# EAGLE design mux2 (EAGLE 6.5.0)
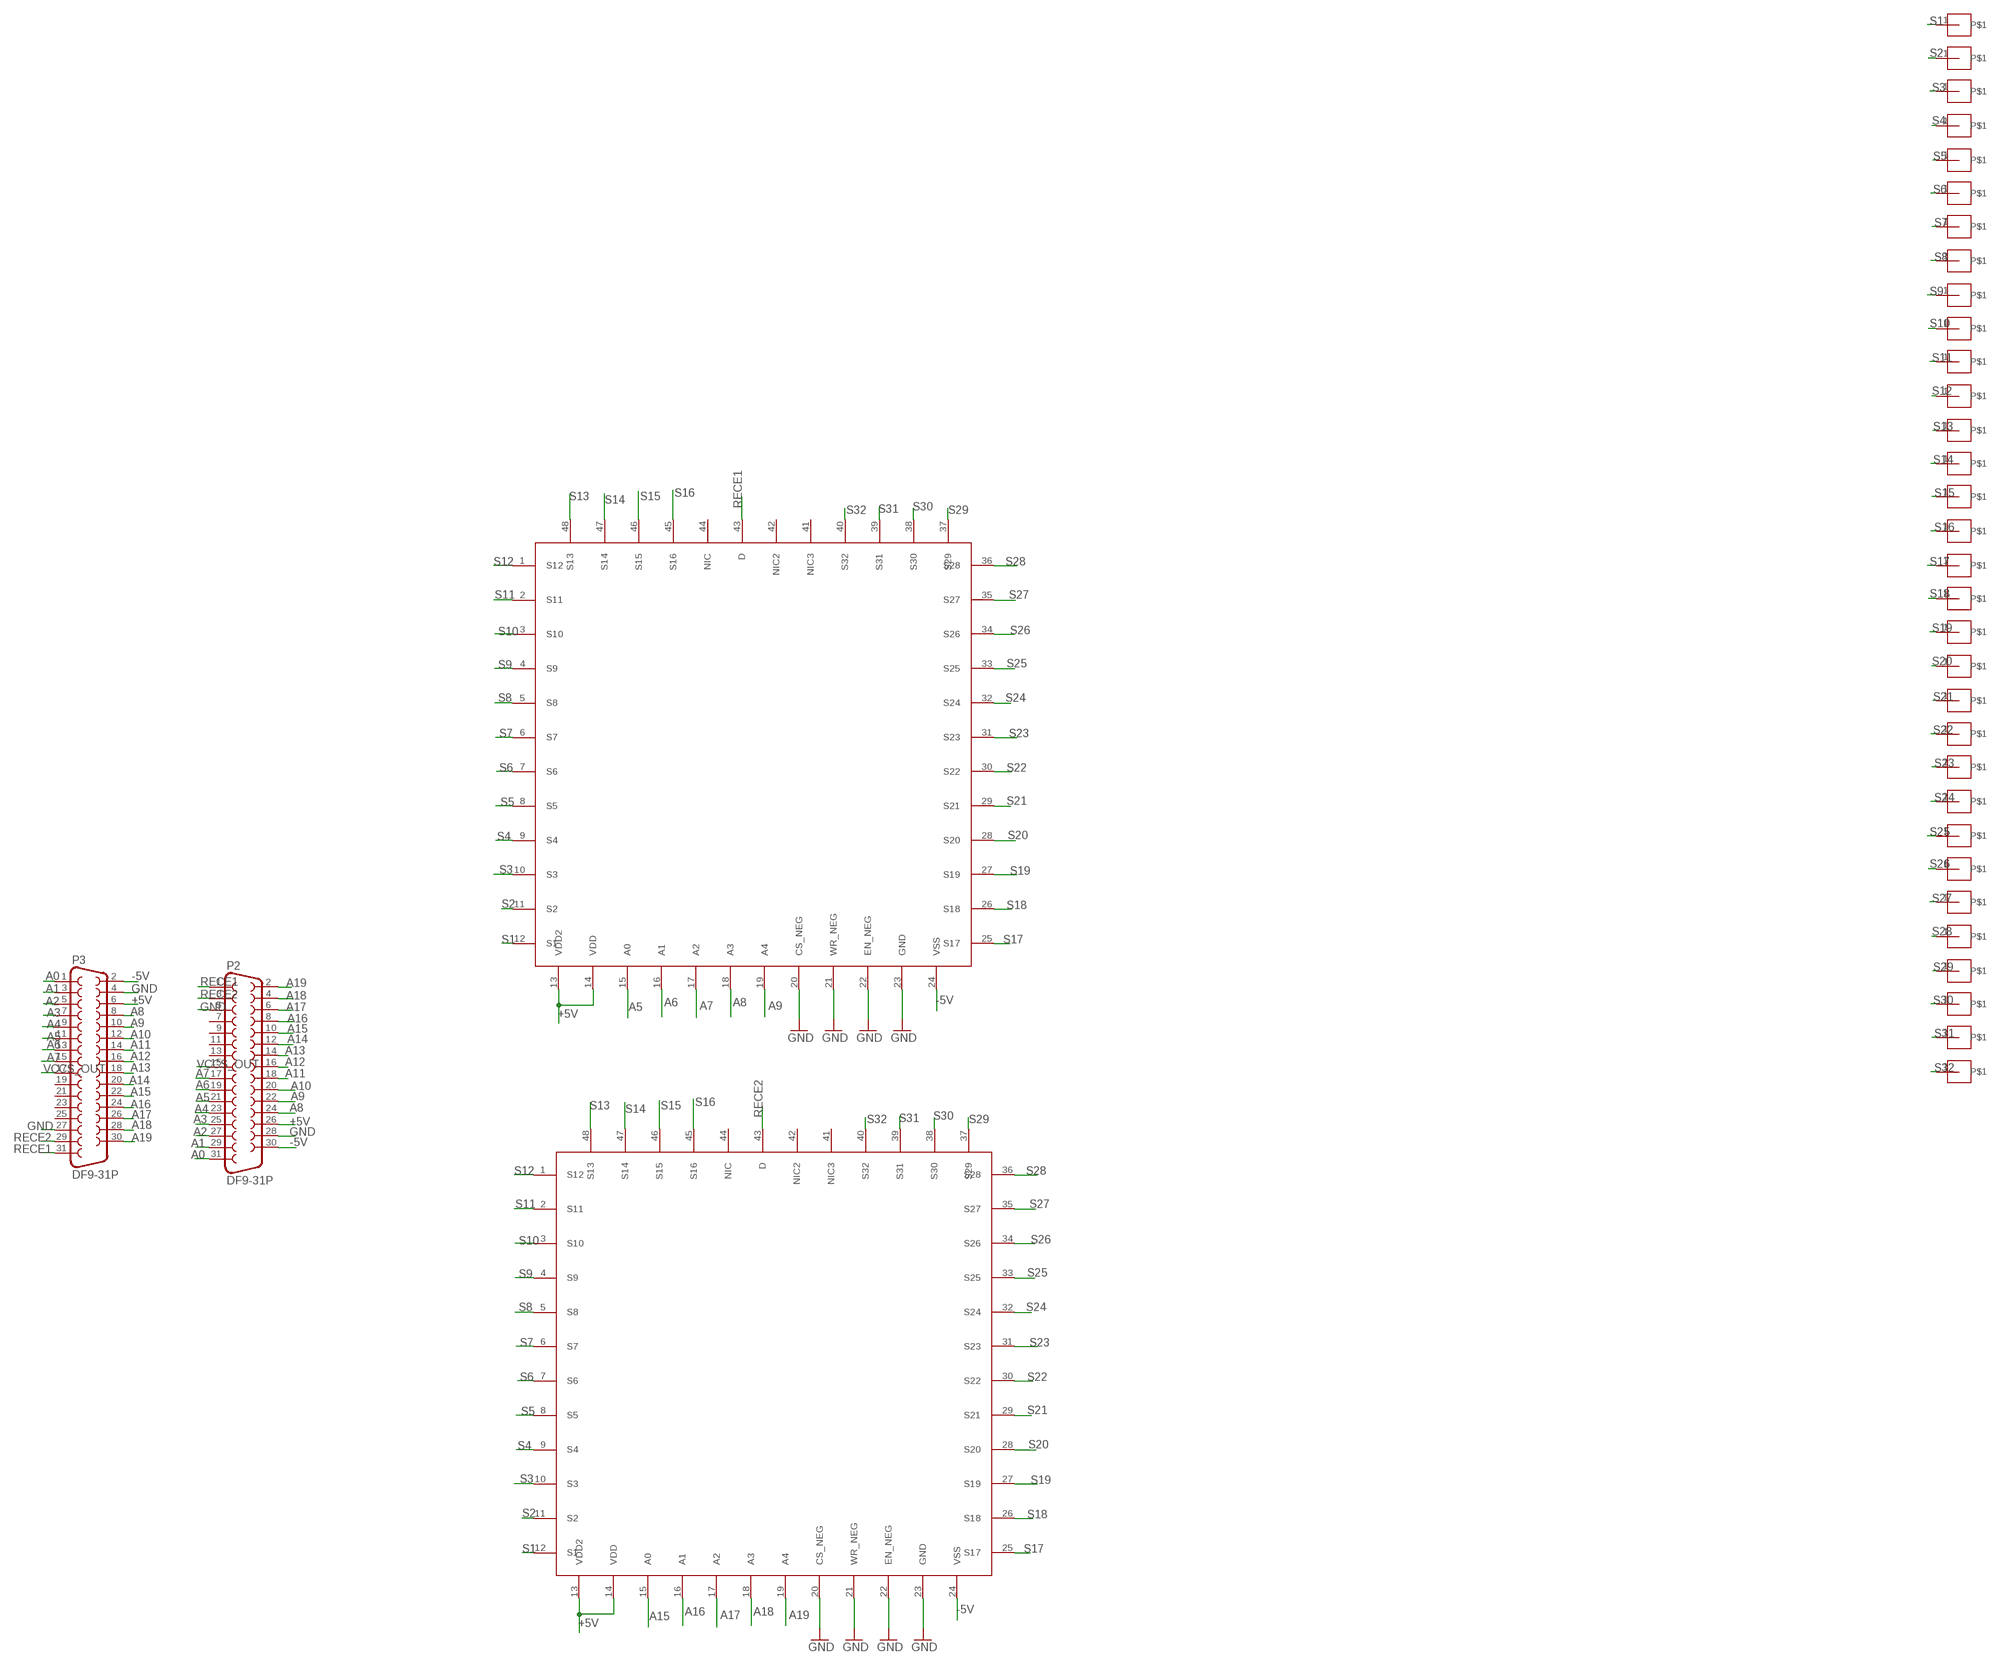
[diagram p0: schematic, sheet 1]

## Parts
P2  DF9-31P  [DF9-31P]
P3  DF9-31P  [DF9-31P]
U$25  M01  [M01]
U$26  M01  [M01]
U$27  M01  [M01]
U$28  M01  [M01]
U$29  M01  [M01]
U$30  M01  [M01]
U$31  M01  [M01]
U$32  M01  [M01]
U$33  M01  [M01]
U$34  M01  [M01]
U$35  M01  [M01]
U$36  M01  [M01]
U$37  M01  [M01]
U$38  M01  [M01]
U$39  M01  [M01]
U$40  M01  [M01]
U$41  M01  [M01]
U$42  M01  [M01]
U$43  M01  [M01]
U$44  M01  [M01]
U$45  M01  [M01]
U$46  M01  [M01]
U$47  M01  [M01]
U$48  M01  [M01]
U$49  M01  [M01]
U$50  M01  [M01]
U$51  M01  [M01]
U$52  M01  [M01]
U$53  M01  [M01]
U$54  M01  [M01]
U$55  M01  [M01]
U$56  M01  [M01]
U$73  ADG732  [TQFP48]
U$74  ADG732  [TQFP48]

## Nets
+5V: P2.26 P3.6 U$73.13(VDD2) U$73.14(VDD) U$74.13(VDD2) U$74.14(VDD)
-5V: P2.30 P3.2 U$73.24(VSS) U$74.24(VSS)
A0: P2.31 P3.1
A1: P2.29 P3.3
A2: P2.27 P3.5
A3: P2.25 P3.7
A4: P2.23 P3.9
A5: P2.21 P3.11 U$74.15(A0)
A6: P2.19 P3.13 U$74.16(A1)
A7: P2.17 P3.15 U$74.17(A2)
A8: P2.24 P3.8 U$74.18(A3)
A9: P2.22 P3.10 U$74.19(A4)
A10: P2.20 P3.12
A11: P2.18 P3.14
A12: P2.16 P3.16
A13: P2.14 P3.18
A14: P2.12 P3.20
A15: P2.10 P3.22 U$73.15(A0)
A16: P2.8 P3.24 U$73.16(A1)
A17: P2.6 P3.26 U$73.17(A2)
A18: P2.4 P3.28 U$73.18(A3)
A19: P2.2 P3.30 U$73.19(A4)
GND: P2.5 P2.28 P3.4 P3.27 U$73.20(CS_NEG) U$73.21(WR_NEG) U$73.22(EN_NEG) U$73.23(GND) U$74.20(CS_NEG) U$74.21(WR_NEG) U$74.22(EN_NEG) U$74.23(GND)
RECE1: P2.1 P3.31 U$74.43(D)
RECE2: P2.3 P3.29 U$73.43(D)
S1: U$25.1 U$73.12(S1) U$74.12(S1)
S2: U$26.1 U$73.11(S2) U$74.11(S2)
S3: U$27.1 U$73.10(S3) U$74.10(S3)
S4: U$28.1 U$73.9(S4) U$74.9(S4)
S5: U$29.1 U$73.8(S5) U$74.8(S5)
S6: U$30.1 U$73.7(S6) U$74.7(S6)
S7: U$31.1 U$73.6(S7) U$74.6(S7)
S8: U$32.1 U$73.5(S8) U$74.5(S8)
S9: U$33.1 U$73.4(S9) U$74.4(S9)
S10: U$34.1 U$73.3(S10) U$74.3(S10)
S11: U$35.1 U$73.2(S11) U$74.2(S11)
S12: U$36.1 U$73.1(S12) U$74.1(S12)
S13: U$37.1 U$73.48(S13) U$74.48(S13)
S14: U$38.1 U$73.47(S14) U$74.47(S14)
S15: U$39.1 U$73.46(S15) U$74.46(S15)
S16: U$40.1 U$73.45(S16) U$74.45(S16)
S17: U$41.1 U$73.25(S17) U$74.25(S17)
S18: U$42.1 U$73.26(S18) U$74.26(S18)
S19: U$43.1 U$73.27(S19) U$74.27(S19)
S20: U$44.1 U$73.28(S20) U$74.28(S20)
S21: U$45.1 U$73.29(S21) U$74.29(S21)
S22: U$46.1 U$73.30(S22) U$74.30(S22)
S23: U$47.1 U$73.31(S23) U$74.31(S23)
S24: U$48.1 U$73.32(S24) U$74.32(S24)
S25: U$49.1 U$73.33(S25) U$74.33(S25)
S26: U$50.1 U$73.34(S26) U$74.34(S26)
S27: U$51.1 U$73.35(S27) U$74.35(S27)
S28: U$52.1 U$73.36(S28) U$74.36(S28)
S29: U$53.1 U$73.37(S29) U$74.37(S29)
S30: U$54.1 U$73.38(S30) U$74.38(S30)
S31: U$55.1 U$73.39(S31) U$74.39(S31)
S32: U$56.1 U$73.40(S32) U$74.40(S32)
VCCS_OUT: P2.15 P3.17
Unconnected: P2.7 P2.9 P2.11 P2.13 P3.19 P3.21 P3.23 P3.25 U$73.41(NIC3) U$73.42(NIC2) U$73.44(NIC) U$74.41(NIC3) U$74.42(NIC2) U$74.44(NIC)

## Library data of the parts
P2 P3 = con-hirose:DF9-31P
U$25-U$56 = Teensy_3_and_LC_Series_Boards_v1.1:M01
U$73 U$74 = Teensy_3_and_LC_Series_Boards_v1.1:ADG732

## Board
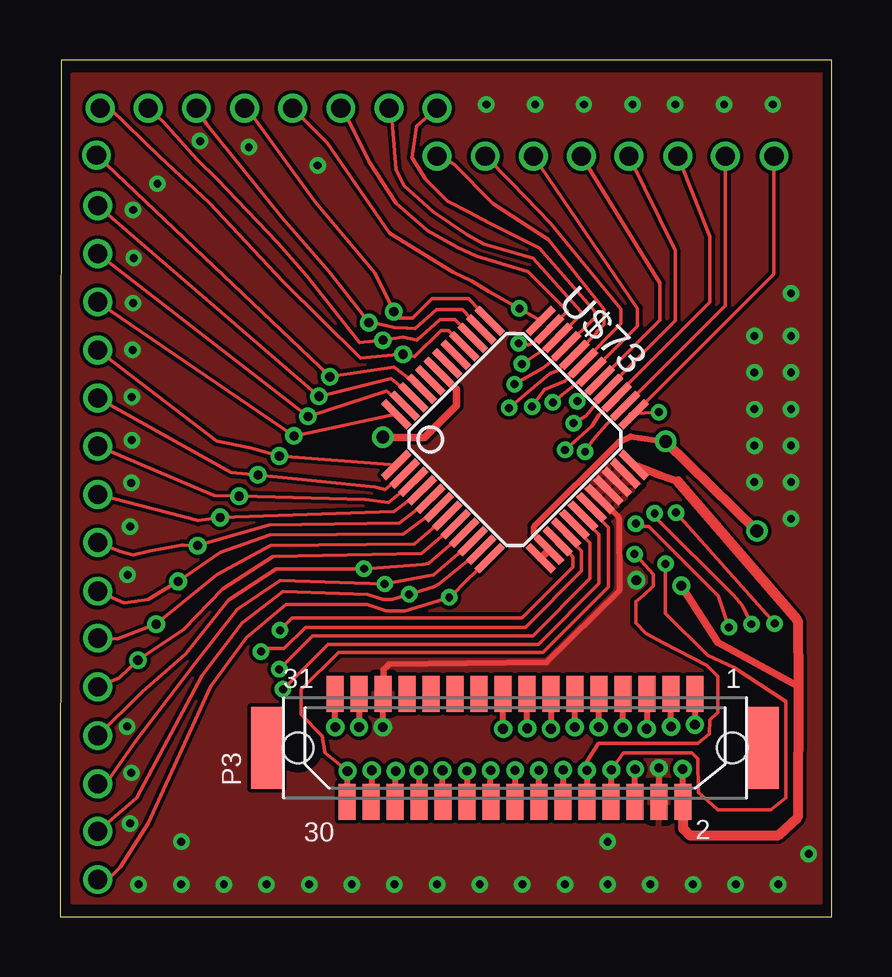
[diagram p1: board, top side]
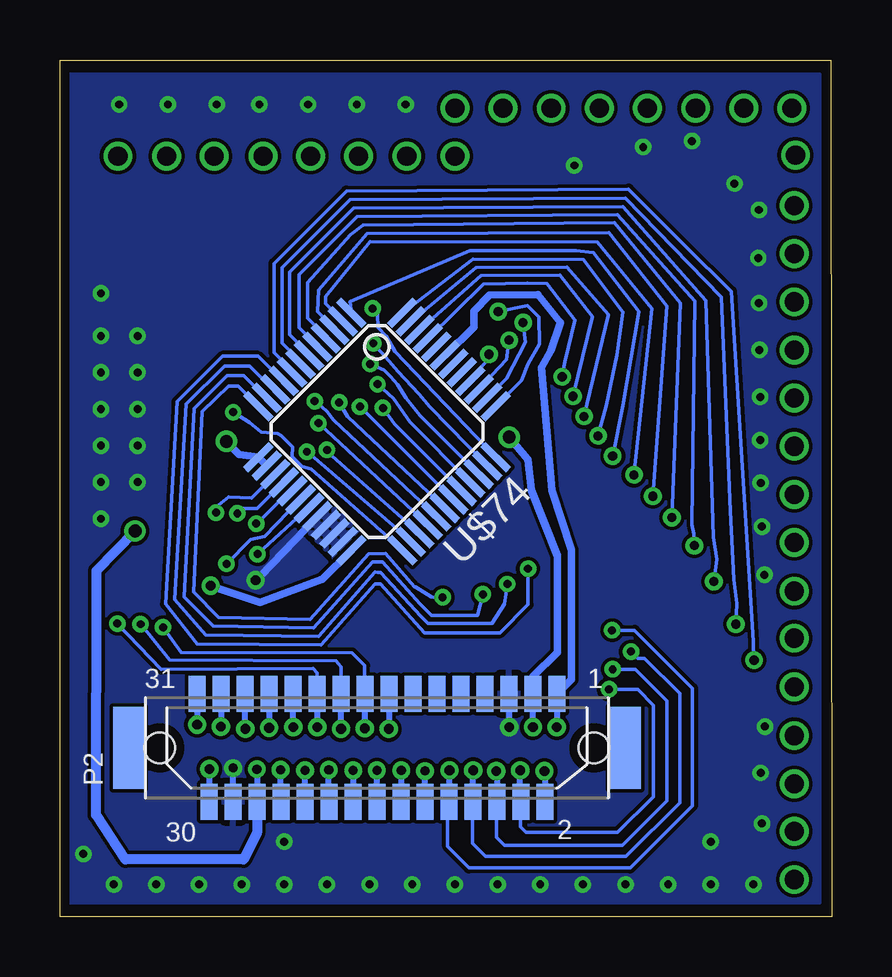
[diagram p2: board, bottom side, seen from below]

Size 32.19 x 35.71 mm. Coordinates in mm from the lower left corner, seen from the top.
Outline: 0,0 32.19,0 32.19,35.71 0.05,35.71 0,0
Copper layers (1*16): Top 0.0356mm / dielectric 1.5011mm / Bottom 0.0356mm
Design rules "LaenPCBOrder": minimum track width 6mil, minimum drill 13mil, track to track 6mil, track to pad 6mil, pad to pad 6mil, via to via 6mil, smd to smd 6mil, copper to edge 15mil, drill to drill 6mil, minimum pad ring 7mil, minimum via ring 7mil, stop-mask expansion 3mil, vias tented up to drill 0mil, thermal gap 10mil

### Footprints (pad centres in the part's own frame; a part is rotated, then mirrored left to right if it is on the bottom)
DF9-31P = smd 0.7 x 1.5: 1 7.5,2.25; 2 7,-2.25; 3 6.5,2.25; 4 6,-2.25; 5 5.5,2.25; 6 5,-2.25; 7 4.5,2.25; 8 4,-2.25; 9 3.5,2.25; 10 3,-2.25; 11 2.5,2.25; 12 2,-2.25; 13 1.5,2.25; 14 1,-2.25; 15 0.5,2.25; 16 0,-2.25; 17 -0.5,2.25; 18 -1,-2.25; 19 -1.5,2.25; 20 -2,-2.25; 21 -2.5,2.25; 22 -3,-2.25; 23 -3.5,2.25; 24 -4,-2.25; 25 -4.5,2.25; 26 -5,-2.25; 27 -5.5,2.25; 28 -6,-2.25; 29 -6.5,2.25; 30 -7,-2.25; 31 -7.5,2.25 | smd 1.3 x 3.4: M1 -10.35,0; M2 10.35,0 | hole 1.27: 9.05,0; -9.05,0
M01 = drill 0.8: 1 -0.025,-0.076
TQFP48 = smd 0.3 x 1.5: 1 -2.75,-4.25; 2 -2.25,-4.25; 3 -1.75,-4.25; 4 -1.25,-4.25; 5 -0.75,-4.25; 6 -0.25,-4.25; 7 0.25,-4.25; 8 0.75,-4.25; 9 1.25,-4.25; 10 1.75,-4.25; 11 2.25,-4.25; 12 2.75,-4.25; 25 2.75,4.25; 26 2.25,4.25; 27 1.75,4.25; 28 1.25,4.25; 29 0.75,4.25; 30 0.25,4.25; 31 -0.25,4.25; 32 -0.75,4.25; 33 -1.25,4.25; 34 -1.75,4.25; 35 -2.25,4.25; 36 -2.75,4.25 | smd 1.5 x 0.3: 13 4.25,-2.75; 14 4.25,-2.25; 15 4.25,-1.75; 16 4.25,-1.25; 17 4.25,-0.75; 18 4.25,-0.25; 19 4.25,0.25; 20 4.25,0.75; 21 4.25,1.25; 22 4.25,1.75; 23 4.25,2.25; 24 4.25,2.75; 37 -4.25,2.75; 38 -4.25,2.25; 39 -4.25,1.75; 40 -4.25,1.25; 41 -4.25,0.75; 42 -4.25,0.25; 43 -4.25,-0.25; 44 -4.25,-0.75; 45 -4.25,-1.25; 46 -4.25,-1.75; 47 -4.25,-2.25; 48 -4.25,-2.75

### Placement (x,y rotation side)
P2  18.97,7.04 0 bottom
P3  18.97,7.04 0 top
U$25  1.6,1.63 0 top
U$26  1.6,3.63 0 top
U$27  1.6,5.61 0 top
U$28  1.6,7.62 0 top
U$29  1.6,9.65 0 top
U$30  1.6,11.68 0 top
U$31  1.6,13.64 0 top
U$32  1.6,15.67 0 top
U$33  1.6,17.68 0 top
U$34  1.6,19.69 0 top
U$35  1.6,21.69 0 top
U$36  1.6,23.7 0 top
U$37  1.6,25.7 0 top
U$38  1.6,27.71 0 top
U$39  1.6,29.72 0 top
U$40  1.6,31.72 270 top
U$41  29.69,31.72 90 top
U$42  27.66,31.72 90 top
U$43  25.68,31.72 90 top
U$44  23.65,31.72 90 top
U$45  21.67,31.72 90 top
U$46  19.66,31.72 90 top
U$47  17.65,31.72 90 top
U$48  15.65,31.72 90 top
U$49  15.65,33.73 90 top
U$50  13.64,33.73 90 top
U$51  11.63,33.73 90 top
U$52  9.63,33.73 90 top
U$53  7.62,33.73 90 top
U$54  5.61,33.73 90 top
U$55  3.61,33.73 90 top
U$56  1.6,33.73 90 top
U$73  18.97,19.89 315 top
U$74  18.97,20.22 225 bottom

### Tracks (layer width: path | path; a pad name or v marks a point on that pad's centre or on a via)
+5V  (via drill 0.38, 0.53)
  Top 0.254: P3.6 v23.97,6.14 v23.98,6.15 | U$73.14 19.76,15.93 19.76,16.26 23.32,19.81 23.8,20.02 v25.25,19.81
  Top 0.305: U$73.14 U$73.13
  Top 0.406: v25.25,19.81 v29.06,16.08
  Bottom 0.254: v23.98,6.15 P3.6
  Bottom 0.305: U$74.14 U$74.13 24.72,19.26 v25.25,19.81
  Bottom 0.406: P3.6 23.97,3.48 24.54,2.39 29.46,2.39 30.68,4.24 30.66,14.43 v29.06,16.08
-5V  (via drill 0.41)
  Top 0.254: P3.2 25.96,4.79 v25.96,6.15
  Top 0.305: U$73.24 25.05,18.4 25.77,18.15 | v25.91,13.79 27.43,11.43 30.78,9.6
  Top 0.406: 25.77,18.15 30.76,12.34 30.78,9.6 30.76,4.14 29.92,3.38 26.26,3.38 25.98,3.66 P3.2
  Bottom 0.254: v25.96,6.15 25.97,6.15 P3.2
  Bottom 0.305: U$74.24 21.26,14.05 21.28,14.05 23.85,13.11 v25.91,13.79
A0  (via drill 0.41)
  Top 0.254: P3.1 v26.47,8.01 v26.47,8
  Bottom 0.152: P3.1
  Bottom 0.254: P3.1 v26.47,8.01 v26.47,8
A1  (via drill 0.41)
  Top 0.254: v25.48,7.93 v25.47,7.93 P3.3
  Bottom 0.254: P3.3 v25.48,7.93
A2  (via drill 0.41)
  Top 0.254: P3.5 24.46,9.29 v24.46,7.82
  Bottom 0.254: v24.46,7.82 24.47,7.82 P3.5
A3  (via drill 0.41)
  Top 0.254: v23.47,7.87 P3.7
  Bottom 0.152: P3.7
  Bottom 0.254: P3.7 v23.47,7.87
A4  (via drill 0.41)
  Top 0.254: P3.9 22.45,9.29 v22.45,7.9
  Bottom 0.152: P3.9
  Bottom 0.254: v22.45,7.9 22.47,7.9 P3.9
A5  (via drill 0.33, 0.41)
  Top 0.152: v25.68,16.84 v29.79,12.22
  Top 0.254: v21.46,7.9 v21.47,7.9 P3.11
  Bottom 0.152: P3.11 21.47,10.17 21.64,10.34 27.96,10.31 v29.79,12.22 | U$74.15 23.26,18.45 23.26,18.4 24.21,17.45 25.15,17.5 25.58,17.17 25.68,17.04 v25.68,16.84
  Bottom 0.254: P3.11 21.46,9.29 v21.46,7.9
A6  (via drill 0.33, 0.41)
  Top 0.152: v24.79,16.82 24.79,16.69 28.07,13.41 28.45,12.98 v28.83,12.19
  Top 0.254: P3.13 v20.47,7.82
  Bottom 0.152: P3.13 20.47,10.42 20.68,10.67 27.61,10.69 v28.83,12.19 | U$74.16 22.9,18.1 23.98,17.02 24.59,17.02 v24.79,16.82
  Bottom 0.254: v20.47,7.82 P3.13
A7  (via drill 0.33, 0.41)
  Top 0.152: v27.89,12.07 27.46,13.36 24.56,16.26 24.13,16.26 v24,16.38
  Top 0.254: v19.48,7.85 19.47,7.85 P3.15
  Bottom 0.152: P3.15 19.48,10.47 20.02,11 27.13,11.02 v27.89,12.07 | U$74.17 22.62,17.74 23.85,16.51 v24,16.38
  Bottom 0.254: P3.15 v19.48,7.85
A8  (via drill 0.33, 0.38)
  Top 0.152: v25.25,14.71 25.25,12.65 27,10.9 28.09,10.39 30.25,8.97 30.25,4.95 29.64,4.45 27.43,4.45 26.62,5.18 26.59,6.58 26.34,6.83 23.49,6.83 v22.99,6.12
  Top 0.254: v22.99,6.12 22.97,6.12 P3.8
  Bottom 0.152: U$74.18 22.18,17.39 23.65,15.85 24.23,15.72 v25.25,14.71
  Bottom 0.254: P3.8 v22.99,6.12
A9  (via drill 0.33, 0.38)
  Top 0.152: v21.97,6.1 21.97,6.48 22.45,7.21 26.59,7.21 27.08,7.62 27.1,8.2 27.43,8.51 27.43,10.01 26.97,10.47 25.15,11.4 24.43,11.81 24,12.24 24,13.13 24.31,13.36 24.74,13.79 24.74,14.28 24.05,15.04 v23.95,15.11
  Top 0.254: v21.97,6.1 P3.10
  Bottom 0.152: U$74.19 21.85,17.04 v23.95,15.11
  Bottom 0.254: P3.10 v21.97,6.1
A10  (via drill 0.38)
  Top 0.254: v20.98,6.12 v20.97,6.12 P3.12
  Bottom 0.254: P3.12 v20.98,6.12
A11  (via drill 0.38)
  Top 0.254: P3.14 19.96,4.79 v19.96,6.1
  Bottom 0.254: v19.96,6.1 v19.97,6.1 P3.14
A12  (via drill 0.38)
  Top 0.254: v18.97,6.1 P3.16
  Bottom 0.254: P3.16 v18.97,6.1
A13  (via drill 0.38)
  Top 0.254: P3.18 17.96,4.79 v17.96,6.1
  Bottom 0.254: v17.96,6.1 17.97,6.1 P3.18
A14  (via drill 0.38)
  Top 0.254: v16.97,6.07 P3.20
  Bottom 0.254: P3.20 v16.97,6.07
A15  (via drill 0.33, 0.41)
  Top 0.152: U$73.15 21.39,14.99 21.39,14.58 19.25,12.45 9.68,12.45 v9.17,11.94
  Top 0.254: P3.22 15.95,4.79 v15.95,6.1
  Bottom 0.152: v9.17,11.94 8.23,11.94 5.82,9.53 5.82,4.62 8.41,2.03 15.14,2.03 16.03,2.92 16.03,4.73 P3.22
  Bottom 0.254: v15.95,6.1 15.97,6.05 P3.22
A16  (via drill 0.33, 0.41)
  Top 0.152: U$73.16 21.09,15.89 21.74,15.24 21.74,14.4 19.41,12.07 10.24,12.07 9.35,11.18 8.51,11.18 v8.38,11.05
  Top 0.254: v14.96,6.1 14.97,6.1 P3.24
  Bottom 0.152: P3.24 14.99,3.05 14.45,2.51 8.58,2.51 6.35,4.75 6.35,9.3 7.82,10.77 8.1,10.77 v8.38,11.05
  Bottom 0.254: P3.24 14.96,4.79 v14.96,6.1
A17  (via drill 0.33, 0.41)
  Top 0.152: U$73.17 21.45,16.22 22.1,15.57 22.1,14.1 19.71,11.71 10.54,11.71 v9.14,10.31
  Top 0.254: P3.26 13.99,4.79 v13.99,6.07
  Bottom 0.152: v9.14,10.31 8.2,10.31 6.88,8.99 6.88,4.83 8.74,2.97 13.66,2.97 13.99,3.3 13.99,4.76 P3.26
  Bottom 0.254: v13.99,6.07 13.97,6.07 P3.26
A18  (via drill 0.33, 0.41)
  Top 0.152: U$73.18 21.8,16.6 22.48,15.93 22.48,13.89 19.94,11.35 11.18,11.35 v9.3,9.47
  Top 0.254: v13,6.1 13,6.02 P3.28
  Bottom 0.152: v9.3,9.47 8.1,9.47 7.44,8.81 7.44,5 8.94,3.51 12.75,3.51 12.98,3.73 P3.28
  Bottom 0.254: P3.28 13,4.79 v13,6.1
A19  (via drill 0.41)
  Top 0.152: U$73.19 22.16,16.94 22.86,16.23 22.86,13.74 20.14,11.02 11.61,11.02 10.06,9.47 10.06,8.43 10.92,7.54 11.05,6.83 v11.99,6.07
  Top 0.254: P3.30 11.99,4.79 v11.99,6.07
  Bottom 0.254: v11.99,6.07 11.97,6.07 P3.30
GND  (via drill 0.33, 0.38, 0.41)
  Top 0.254: v13.46,7.9 13.47,8.05 P3.27 13.49,9.3 13.49,10.29 13.72,10.52 20.27,10.59 23.32,13.59 23.29,16.64 U$73.20 | v24.97,6.2 P3.4
  Bottom 0.254: P3.27 v13.46,7.9 | P3.4 v24.97,6.2
  Bottom 0.305: U$74.20 23.82,14.2 v24.03,14.02
  other vias: 30.48,16.59 30.48,18.11 30.48,19.63 30.48,21.16 30.48,22.68 30.48,24.21 30.48,25.98 28.96,24.21 28.96,22.68 28.96,21.16 28.96,19.63 28.96,18.11 29.72,33.86 27.69,33.86 25.65,33.86 23.88,33.86 21.84,33.86 19.81,33.86 17.78,33.86 10.74,31.32 7.87,32.08 5.84,32.33 4.06,30.56 3.05,29.46 3.07,27.46 3.05,25.58 3.02,23.62 3,21.67 3,19.86 2.97,18.08 2.92,16.26 2.92,3.89 2.97,5.99 2.79,7.92 2.82,14.25 3.28,1.35 5.05,1.35 6.83,1.35 8.61,1.35 10.39,1.35 12.17,1.35 13.94,1.35 15.72,1.35 17.5,1.35 19.28,1.35 21.06,1.35 22.83,1.35 24.61,1.35 26.39,1.35 28.17,1.35 29.95,1.35 31.22,2.62 5.05,3.12 22.83,3.12
  pour Bottom: 0.51,35.13 31.75,35.13 31.75,0.58 0.51,0.58
  pour Top: 0.51,0.58 31.75,0.58 31.75,35.13 0.51,35.13
RECE1  (via drill 0.41)
  Top 0.254: v11.48,7.9 11.47,8.08 P3.31
  Bottom 0.254: P3.31 11.45,9.29 v11.48,7.9
  Bottom 0.305: U$74.43 16.12,23.4 14.93,24.59 14.93,25.25 14.27,25.91 12.27,25.93 11.33,24.77 11.71,23.6 12.12,22.89 11.68,17.75 10.87,15.29 10.87,9.89 P3.31
RECE2  (via drill 0.41, 0.53)
  Top 0.254: P3.29 v12.47,7.9
  Top 0.305: U$73.43 16.53,21.97 16.53,21.31 15.19,19.96 13.49,19.96 v13.46,19.99
  Bottom 0.254: v12.47,7.9 P3.29
  Bottom 0.305: P3.29 12.47,10.01 11.45,11.02 11.45,15.04 12.52,17.75 12.67,19.05 v13.46,19.99
S1  (via drill 0.33)
  Top 0.152: U$25.1 2.01,1.55 2.52,2.06 3.68,3.89 6.27,9.6 7.77,11.63 9.42,13.01 12.8,13.01 13.61,12.75 14.38,12.75 v16.23,13.31 16.41,13.46 16.89,13.94 U$73.12
  Bottom 0.152: U$74.12 24.77,22.12 25.15,22.12 26.26,21.06 26.62,13.54 25.58,12.47 21.77,12.4 19.33,15.11 18.62,15.14 17.4,13.74 17.37,13.74 16.69,13.34 16.46,13.28 v16.23,13.31
S2  (via drill 0.33)
  Top 0.152: U$26.1 3.2,4.95 5.92,10.06 7.59,12.24 9.3,13.56 12.83,13.44 13.46,13.23 13.84,13.23 v14.55,13.44 15.58,13.74 15.81,13.87 U$73.11
  Bottom 0.152: U$74.11 23.61,21.63 24.54,22.56 25.22,22.56 26.59,21.18 27,13.34 25.81,12.12 21.61,12.04 19.15,14.78 18.74,14.78 17.17,13.03 16.69,12.55 14.78,12.55 v14.55,13.44
S3  (via drill 0.33)
  Top 0.152: U$27.1 1.91,5.54 3.17,7.34 5.61,10.54 7.39,12.8 9.17,14.02 v13.54,13.87 15.33,14.2 15.58,14.25 U$73.10
  Bottom 0.152: U$74.10 23.31,21.99 24.28,22.96 25.32,22.96 26.92,21.36 27.41,13.23 26.11,11.74 21.41,11.68 19.05,14.38 18.92,14.35 18.82,14.35 17.14,12.52 16.84,12.22 14.17,12.22 13.66,13.03 v13.54,13.87
S4  (via drill 0.33)
  Top 0.152: U$28.1 3.43,9.37 5.23,10.95 7.04,13.21 9.02,14.5 v12.67,14.5 15.13,14.68 15.36,14.73 U$73.9
  Bottom 0.152: U$74.9 22.9,22.34 23.93,23.37 25.4,23.37 27.3,21.46 27.79,13.03 26.47,11.38 21.31,11.33 19.05,13.87 18.82,13.87 16.99,11.84 13.84,11.84 12.67,13.01 v12.67,14.5
S5  (via drill 0.38)
  Top 0.152: U$29.1 2.46,9.96 v3.25,10.69 5.16,11.96 6.78,13.67 8.89,15.01 15.08,15.14 U$73.8
  Bottom 0.152: U$74.8 22.51,22.76 23.27,23.52 23.27,27.23 20.24,30.25 8.48,30.33 6.15,27.99 4.19,26.06 3.28,11.48 v3.25,10.69
S6  (via drill 0.38)
  Top 0.152: U$30.1 2.39,11.58 v4.01,12.19 6.55,14.28 8.79,15.47 14.78,15.55 U$73.7
  Bottom 0.152: U$74.7 22.16,23.12 22.94,23.9 22.94,27.05 20.09,29.9 8.61,29.95 4.62,25.83 4.24,16.92 4.09,14.05 3.96,13.06 v4.01,12.19
S7  (via drill 0.38)
  Top 0.152: U$31.1 2.67,13.08 3.68,13.23 4.32,13.61 v4.93,13.97 6.68,15.19 8.74,15.9 14.33,15.95 U$73.6
  Bottom 0.152: U$74.6 21.8,23.45 22.61,24.26 22.61,26.87 19.94,29.54 8.71,29.59 5.26,25.68 4.95,15.82 4.8,14.88 v4.93,13.97
S8  (via drill 0.38)
  Top 0.152: U$32.1 2.52,15.21 3.05,15.09 3.73,15.24 5.1,15.49 v5.74,15.47 8.71,16.33 14.15,16.41 U$73.5
  Bottom 0.152: U$74.5 21.45,23.79 22.22,24.56 22.22,26.77 19.81,29.18 8.94,29.26 5.71,25.65 5.84,16.36 5.77,15.95 v5.74,15.47
S9  (via drill 0.38)
  Top 0.152: U$73.4 13.93,16.89 v6.68,16.64 5.77,16.51 U$33.1
  Bottom 0.152: U$74.4 21.09,24.17 21.87,24.94 21.87,26.44 20.07,28.42 19.56,28.83 9.07,28.93 6.32,25.58 v6.68,16.64
S10  (via drill 0.38)
  Top 0.152: U$73.3 13.7,17.27 12.72,17.4 v7.47,17.53 6.43,17.55 U$34.1
  Bottom 0.152: U$74.3 20.74,24.53 21.44,25.22 21.41,26.11 19.38,28.47 9.3,28.52 6.88,25.45 v7.47,17.53
S11  (via drill 0.38)
  Top 0.152: U$73.2 13.56,17.81 13.13,17.91 v8.25,18.42 7.14,18.52 U$35.1
  Bottom 0.152: U$74.2 20.39,24.83 21.11,25.55 21.11,25.86 19.25,28.14 9.78,28.12 7.52,25.35 v8.25,18.42
S12  (via drill 0.38)
  Top 0.152: U$36.1 6.53,19.84 7.97,19.53 v9.14,19.2 U$73.1
  Bottom 0.152: U$74.1 20.08,25.64 15.09,27.76 10.67,27.76 9.96,27.69 8.05,25.22 8.71,21.31 v9.14,19.2
S13  (via drill 0.38)
  Top 0.152: U$73.48 v9.75,20.04 U$37.1
  Bottom 0.152: U$74.48 14.96,27.41 10.36,27.38 8.71,25.2 8.97,23.42 9.4,21.34 v9.75,20.04
S14  (via drill 0.38)
  Top 0.152: U$73.47 13.61,21.92 v10.34,20.85 U$38.1
  Bottom 0.152: U$74.47 14.83,27.05 11.05,27.08 9.32,25.1 v10.34,20.85
S15  (via drill 0.38)
  Top 0.152: U$73.46 13.81,22.43 v10.79,21.69 U$39.1
  Bottom 0.152: U$74.46 14.63,26.72 11.35,26.75 9.98,25.02 v10.79,21.69
S16  (via drill 0.38)
  Top 0.152: U$73.45 13.93,22.91 v11.25,22.5 U$40.1
  Bottom 0.152: U$74.45 14.53,26.37 12.7,26.42 11.89,26.39 10.72,24.87 11.12,23.14 v11.25,22.5
S17  (via drill 0.33)
  Top 0.152: v24.97,21.03 23.77,20.95 U$73.25 29.77,26.79 U$41.1
  Bottom 0.152: v24.97,21.03 24.28,20.6 23.8,20.19 23.11,20.14 22.96,20.07 22.48,19.58 22.5,19.18 22.1,18.77 21.72,18.67 19.02,16.28 18.97,16.23 18.41,15.75 18.31,15.65 18.29,15.65 U$74.25
S18  (via drill 0.33)
  Top 0.152: v21.89,19.38 22.22,19.86 22.78,20.52 U$73.26 27.74,25.47 U$42.1
  Bottom 0.152: U$74.26 17.58,15.67 v21.89,19.38
S19  (via drill 0.33)
  Top 0.152: v21.06,19.46 22.17,20.45 22.48,20.9 U$73.27 23.22,21.74 27.1,25.63 27.1,28.35 U$43.1
  Bottom 0.152: v21.06,19.46 20.84,19.2 U$74.27
S20  (via drill 0.33)
  Top 0.152: U$44.1 25.65,27.76 25.65,24.84 22.86,22.05 U$73.28 21.92,20.88 v21.41,20.57
  Bottom 0.152: U$74.28 v21.41,20.57
S21  (via drill 0.33)
  Top 0.152: v21.56,21.49 21.89,21.79 21.95,21.82 22.49,22.36 U$73.29 25.02,24.87 25.02,26.42 U$45.1
  Bottom 0.152: v21.56,21.49 21.26,21.23 21.06,21.06 20.78,20.71 U$74.29
S22  (via drill 0.33)
  Top 0.152: v20.55,21.44 20.95,21.77 21.26,22.02 U$73.30 22.18,22.72 24.08,24.61 24.08,25.35 U$46.1
  Bottom 0.152: v20.55,21.44 20.19,20.86 U$74.30
S23  (via drill 0.33)
  Top 0.152: v19.68,21.26 20.19,21.97 21.06,22.33 U$73.31 21.8,23.12 23.39,24.71 23.39,25.32 20.45,28.91 18.82,30.61 U$47.1
  Bottom 0.152: v19.68,21.26 19.15,20.75 U$74.31
S24  (via drill 0.33)
  Top 0.152: v18.72,21.21 20.42,22.63 20.75,22.76 21.42,23.42 U$73.32 22.38,24.35 22.38,24.38 22.68,24.69 22.68,25.32 20.37,28.22 18.06,29.72 16.43,31.37 U$48.1
  Bottom 0.152: v18.72,21.21 18.24,20.54 U$74.32
S25  (via drill 0.33)
  Top 0.152: v18.95,22.2 20.14,22.86 20.42,23.09 21.09,23.76 U$73.33 22.3,24.98 22.3,25.22 19.99,27.86 17.91,28.91 17.04,29.36 16.15,29.82 15.24,30.73 14.68,31.65 14.86,32.94 U$49.1
  Bottom 0.152: v18.95,22.2 18.29,21.59 17.6,20.61 U$74.33
S26  (via drill 0.33)
  Top 0.152: v19.25,23.04 20.21,23.66 20.74,24.12 U$73.34 21.72,25.11 21.72,25.22 19.71,27.46 17.68,28.04 16.97,28.42 15.54,29.39 14.35,30.48 14.02,31.14 13.79,33.71 U$50.1
  Bottom 0.152: v19.25,23.04 18.67,22.78 18.41,22.5 18.11,22.17 17.75,21.62 17.17,20.89 U$74.34
S27  (via drill 0.33)
  Top 0.152: v19.13,23.9 19.51,23.83 19.76,23.93 20.37,24.48 U$73.35 21.15,25.25 21.16,25.25 19.51,26.9 17.37,27.53 16.59,27.89 15.32,28.6 14.02,29.74 12.88,31.47 11.89,33.5 U$51.1
  Bottom 0.152: v19.13,23.9 18.8,23.55 18.47,23.17 18.08,22.73 17.22,21.79 16.76,21.24 U$74.35
S28  (via drill 0.33)
  Top 0.152: U$52.1 11.12,32.26 13.74,28.5 16.38,26.87 17.17,26.49 17.88,26.06 v19.15,25.35 U$73.36
  Bottom 0.152: v19.15,25.35 18.95,25.1 18.92,24.56 18.59,24.21 18.21,23.55 U$74.36
S29  (via drill 0.38)
  Top 0.152: U$53.1 8,33.4 10.62,29.82 13.13,26.82 v13.92,25.22 14.05,24.94 14.71,24.94 15.52,25.76 17.02,25.76 U$73.37
  Bottom 0.152: v13.92,25.22 12.7,25.48 12.22,24.99 12.19,23.88 12.67,23.04 12.95,22.35 U$74.37
S30  (via drill 0.38)
  Top 0.152: U$54.1 6.12,33.05 9.25,29.16 11.23,26.9 v12.88,24.77 12.88,24.82 13.94,24.56 14.48,24.54 14.81,24.51 15.7,25.3 16.77,25.3 U$73.38
  Bottom 0.152: U$74.38 14.36,21.63 13.56,22.43 12.78,23.95 v12.88,24.77
S31  (via drill 0.38)
  Top 0.152: U$55.1 4.29,33.15 5.71,31.55 6.55,30.73 9.07,28.09 10.29,26.72 12.5,23.93 v13.46,24.03 14.3,24.16 14.88,24.03 15.85,24.89 16.47,24.89 U$73.39
  Bottom 0.152: U$74.39 14.72,21.99 14.17,22.58 13.56,23.22 v13.46,24.03
S32  (via drill 0.38)
  Top 0.152: U$56.1 2.08,33.71 4.14,31.7 6.22,29.77 9.3,26.47 12.52,23.29 v14.3,23.44 14.45,23.42 14.78,23.34 15.88,24.44 16.19,24.44 U$73.40
  Bottom 0.152: U$74.40 15.07,22.34 14.43,23.14 v14.3,23.44
VCCS_OUT  (via drill 0.41)
  Top 0.254: v18.47,7.82 P3.17
  Bottom 0.254: P3.17 v18.47,7.82